# Altium schematic sheet Sensor.schdoc
size 265 x 151 mm; SheetNumber: 2; SheetTotal: 2
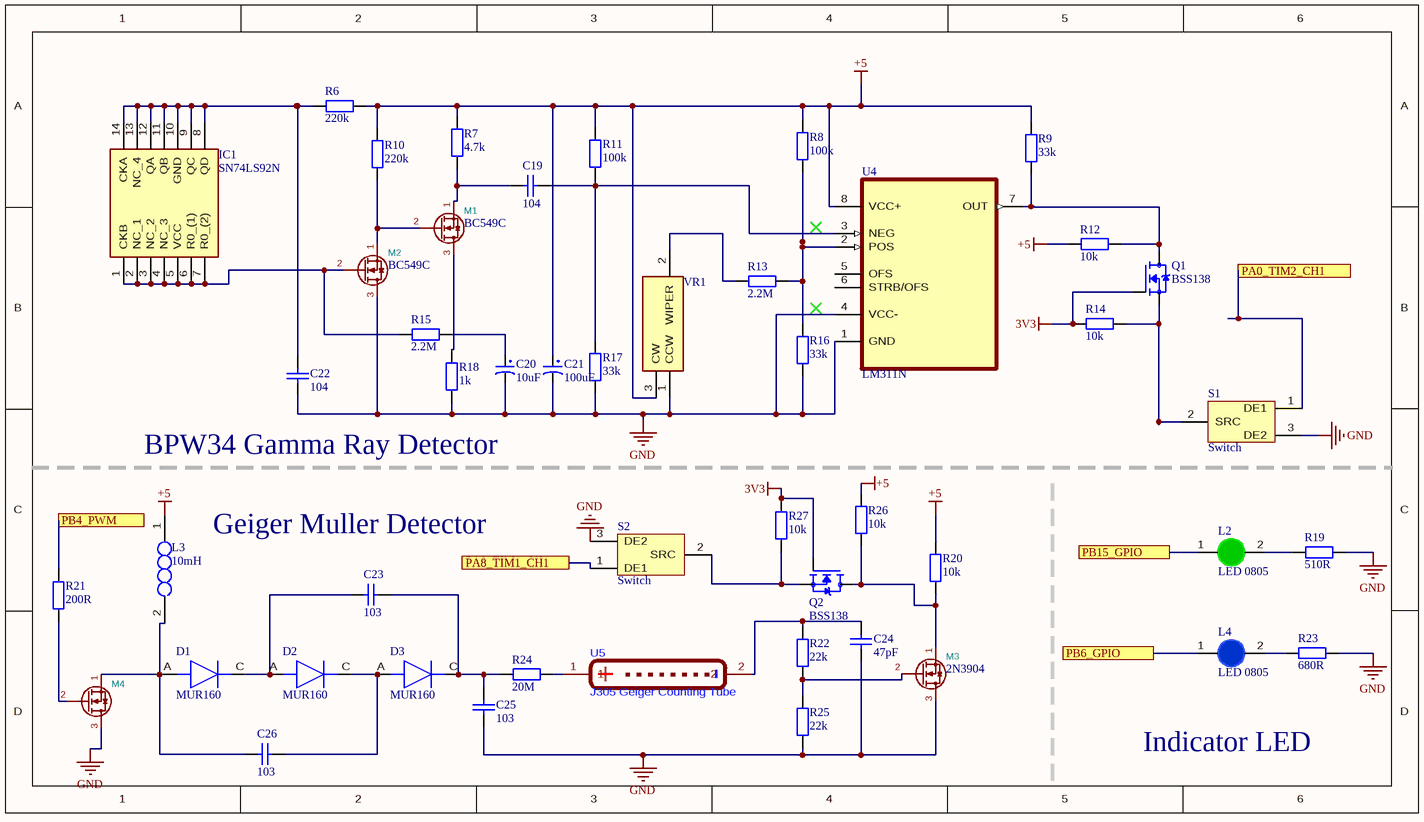
[diagram p0: Sensor.schdoc]

## Parts
C19  104  [tu 0805]
C20  10uF  [tu tantalum smd3216]
C21  100uF  [tu tantalum smd7343]
C22  104  [tu 0805]
C23  103  [tu gom]
C24  47pF  [tu 0805]
C25  103  [tu gom]
C26  103  [tu gom]
D1  MUR160  [DIOAD1300W80L670D310]
D2  MUR160  [DIOAD1300W80L670D310]
D3  MUR160  [DIOAD1300W80L670D310]
IC1  SN74LS92N  [DIP794W53P254L1930H508Q14N]
L2  LED 0805  [LED-0805-Green]
L3  10mH  [RLB1314-101KL]
L4  LED 0805  [LED-0805-Blue]
M1  BC549C  [BC549C]
M2  BC549C  [BC549C]
M3  2N3904  [BC549C]
M4  (no value)  [MJE13003]
Q1  BSS138  [SOT95P240X111-3N]
Q2  BSS138  [SOT95P240X111-3N]
R6  220k  [tro smd 0805]
R7  4.7k  [tro smd 0805]
R8  100k  [tro smd 0805]
R9  33k  [tro smd 0805]
R10  220k  [tro smd 0805]
R11  100k  [tro smd 0805]
R12  10k  [tro smd 0805]
R13  2.2M  [tro smd 0805]
R14  10k  [tro smd 0805]
R15  2.2M  [tro smd 0805]
R16  33k  [tro smd 0805]
R17  33k  [tro smd 0805]
R18  1k  [tro smd 0805]
R19  510R  [tro smd 0805]
R20  10k  [tro smd 0805]
R21  200R  [tro smd 0805]
R22  22k  [tro smd 0805]
R23  680R  [Tro SMD 0805]
R24  20M  [tro smd 0805]
R25  22k  [tro smd 0805]
R26  10k  [tro smd 0805]
R27  10k  [tro smd 0805]
S1  Switch  [Switch]
S2  Switch  [Switch]
U4  LM311N  [LM311N]
U5  J305 Geiger Counting Tube  [GEIGER-TUBE-SMD_J305]
VR1  (no value)  [3362P_1]

## Ports
PA0_TIM2_CH1, PA8_TIM1_CH1, PB4_PWM, PB6_GPIO, PB15_GPIO

## Nets
3V3: Q1.1(G) Q2.1(G) R14.2 R27.2
+5: C21.1 L3.1 R6.2 R7.2 R8.2 R9.2 R10.2 R11.2 R12.2 R20.2 R26.2 U4.8(VCC+) VR1.3(CW)
GND: C20.2 C21.2 C22.2 C24.2 C25.2 M2.3(D) M3.3(D) M4.3(D) R16.1 R17.1 R18.1 R19.2 R23.2 R25.1 S1.3(DE2) S2.3(DE2) U4.1(GND) U4.4(VCC-) VR1.1(CCW)
PA0_TIM2_CH1: S1.1(DE1) ; port PA0_TIM2_CH1
PA8_TIM1_CH1: S2.1(DE1) ; port PA8_TIM1_CH1
PB4_PWM: R21.2 ; port PB4_PWM
PB6_GPIO: L4.1(A) ; port PB6_GPIO
PB15_GPIO: L2.1(A) ; port PB15_GPIO
NetC19_1: C19.1 M1.1(S) R7.1
NetC19_2: C19.2 R11.1 R17.2 U4.3(NEG)
NetC20_1: C20.1 R15.2
NetC22_1: C22.1 IC1.8(QD) IC1.9(QC) IC1.10(GND) IC1.11(QB) IC1.12(QA) IC1.13(NC_4) IC1.14(CKA) R6.1
NetC23_1: C23.1 C25.1 D3.C(K) R24.1
NetC23_2: C23.2 D1.C(K) D2.A
NetC24_1: C24.1 R22.2 U5.2
NetC26_1: C26.1 D2.C(K) D3.A
NetC26_2: C26.2 D1.A L3.2 M4.1(S)
NetIC1_1: IC1.1(CKB) IC1.2(NC_1) IC1.3(NC_2) IC1.4(NC_3) IC1.5(VCC) IC1.6(R0_(1)) IC1.7(R0_(2)) M2.2(G) R15.1
NetL2_2: L2.2(K) R19.1
NetL4_2: L4.2(K) R23.1
NetM1_2: M1.2(G) M2.1(S) R10.1
NetM1_3: M1.3(D) R18.2
NetM3_1: M3.1(S) Q2.3(D) R20.1 R26.1
NetM3_2: M3.2(G) R22.1 R25.2
NetM4_2: M4.2(G) R21.1
NetQ1_2: Q1.2(S) R14.1 S1.2(SRC)
NetQ1_3: Q1.3(D) R9.1 R12.1 U4.7(OUT)
NetQ2_2: Q2.2(S) R27.1 S2.2(SRC)
NetR8_1: R8.1 R13.2 R16.2 U4.2(POS)
NetR13_1: R13.1 VR1.2(WIPER)
NetR24_2: R24.2 U5.1

Not connected (* = marked no-connect by the designer): S1 4 5; S2 4 5; U4 5(OFS) 6(STRB/OFS)

## Notes on the sheet
- BPW34 Gamma Ray Detector
- Geiger Muller Detector
- Indicator LED
- (in symbol J305 Geiger Counting Tube) +; -

## Library data of the parts
C19 C22 = Tu 0805 104 50V 10%: Dán; Don_Vi: Con; So_Chan: 2; Ten_Linh_Kien: Tụ 0805 104-100nF 10% 50V; Ma_Hang: MH004551; Chung_Loai: Dán; Kieu_Chan: *
C20 = Tu tantalum 10uF 16V SMD3216: Dán; Don_Vi: Con; So_Chan: 2; Ten_Linh_Kien: Tụ tantalum 106C-10uF 16V SMD3216; Ma_Hang: MH001954; Chung_Loai: Dán; Kieu_Chan: *
C21 = Tu tantalum 100uF 16V SMD7343: Dán; Don_Vi: Con; So_Chan: 2; Ten_Linh_Kien: Tụ tantalum 107C-100uF 16V SMD7343; Ma_Hang: MH002346; Chung_Loai: Dán; Kieu_Chan: *
C23 C25 C26 = Tu gom 103 50V: Cắm; So_Chan: 2; Ten_Linh_Kien: Tụ gốm 103 10nF 50V; Don_Vi: Con; Ma_Hang: MH000936; Chung_Loai: Cắm; Kieu_Chan: *
C24 = Tu 0805 33pF 50V 10%: Dán; Don_Vi: Con; So_Chan: 2; Ten_Linh_Kien: Tụ 0805 33p 10% 50V; Ma_Hang: MH004563; Chung_Loai: Dán; Kieu_Chan: *
D1-D3 = MUR160: Diode; Manufacturer_Name: onsemi; Manufacturer_Part_Number: UF4007; Datasheet Link: https://www.onsemi.com/pub/Collateral/UF4007-D.pdf; Mouser Part Number: 512-UF4007; Mouser Price/Stock: https://www.mouser.co.uk/ProductDetail/onsemi-Fairchild/UF4007?qs=NwIfwa72FlplAHiXupLMBA%3D%3D; Arrow Part Number: UF4007; Arrow Price/Stock: https://www.arrow.com/en/products/uf4007/on-semiconductor?utm_currency=USD&region=europe
IC1 = SN74LS92N: Integrated Circuit; Manufacturer_Name: Texas Instruments; Datasheet Link: http://www.ti.com/lit/gpn/sn74ls92; Height: 5.08mm; Manufacturer_Part_Number: SN74LS92N; Mouser Part Number: 595-SN74LS92N; Mouser Price/Stock: https://www.mouser.co.uk/ProductDetail/Texas-Instruments/SN74LS92N?qs=UG%2F8xqv%2F6WcRLlC4vw0bYA%3D%3D; Arrow Part Number: SN74LS92N; Arrow Price/Stock: https://www.arrow.com/en/products/sn74ls92n/texas-instruments?utm_currency=USD&region=nac
L2 = LED 0805 Xanh La: Dán; Don_Vi: Con; Ma_Hang: MH002326; Ten_Linh_Kien: LED 0805 Màu Xanh Lá (Green); Ghi_Chu: *; Kieu_Chan: *; Chung_Loai: Dán
L3 = RLB1314-101KL: Inductor; Manufacturer_Name: Bourns; Datasheet Link: https://datasheet.datasheetarchive.com/originals/distributors/SFDatasheet-7/sf-000140383.pdf; Manufacturer_Part_Number: RLB1314-101KL; Mouser Part Number: 652-RLB1314-101KL; Mouser Price/Stock: https://www.mouser.co.uk/ProductDetail/Bourns/RLB1314-101KL?qs=AC4ivEYFOTANeGVpHnHmUA%3D%3D; Arrow Part Number: RLB1314-101KL; Arrow Price/Stock: https://www.arrow.com/en/products/rlb1314-101kl/bourns?region=europe
L4 = LED 0805 Xanh Duong: Dán; Don_Vi: Con; Ma_Hang: MH002327; Ten_Linh_Kien: LED 0805 Màu Xanh Dương (Blue); Ghi_Chu: *; Kieu_Chan: *; Chung_Loai: Dán
M1-M3 = BC549C: ki_keywords: MOSFET N-channel; ki_description: N-Channel Power-MOSFET
M4 = MJE13003: ki_keywords: MOSFET N-channel; ki_description: N-Channel Power-MOSFET
Q1 Q2 = BSS138: N-Channel 50 V 220mA (Ta) 350mW (Ta) Surface Mount SOT-23-3; MF: onsemi; SnapEDA_Link: https://www.snapeda.com/parts/BSS138/Onsemi/view-part/?ref=snap; Package: SOT-23-3 ON Semiconductor; Value: *; MP: BSS138; Check_prices: https://www.snapeda.com/parts/BSS138/Onsemi/view-part/?ref=eda
R6 R10 R13 R15 = Tro 0805 5% 220k: Dán; Don_Vi: Con; So_Chan: 2; Ten_Linh_Kien: Trở 0805 5% 220k; Ma_Hang: MH005258; Chung_Loai: Dán; Kieu_Chan: *
R7 = Tro 0805 5% 4.7k: Dán; Don_Vi: Con; So_Chan: 2; Ten_Linh_Kien: Trở 0805 5% 4.7k; Ma_Hang: MH005307; Chung_Loai: Dán; Kieu_Chan: *
R8 R11 = Tro 0805 5% 100k: Dán; Don_Vi: Con; So_Chan: 2; Ten_Linh_Kien: Trở 0805 5% 100k; Ma_Hang: MH005250; Chung_Loai: Dán; Kieu_Chan: *
R9 R16 R17 = Tro 0805 5% 33k: Dán; Don_Vi: Con; So_Chan: 2; Ten_Linh_Kien: Trở 0805 5% 33k; Ma_Hang: MH005316; Chung_Loai: Dán; Kieu_Chan: *
R12 R14 R20 R26 R27 = Tro 0805 5% 10k: Dán; Don_Vi: Con; So_Chan: 2; Ten_Linh_Kien: Trở 0805 5% 10k; Ma_Hang: MH005239; Chung_Loai: Dán; Kieu_Chan: *
R18 = Tro 0805 1% 1k: Dán; Don_Vi: Con; So_Chan: 2; Ten_Linh_Kien: Trở 0805 1% 1k; Ma_Hang: MH005468; Chung_Loai: Dán; Kieu_Chan: *
R19 = Tro 0805 1% 510k: Dán; Don_Vi: Con; So_Chan: 2; Ten_Linh_Kien: Trở 0805 1% 510k; Ma_Hang: MH005486; Chung_Loai: Dán; Kieu_Chan: *
R21 = Tro 0805 5% 200R: Dán; Don_Vi: Con; So_Chan: 2; Ten_Linh_Kien: Trở 0805 5% 200R; Ma_Hang: MH005257; Chung_Loai: Dán; Kieu_Chan: *
R22 R24 R25 = Tro 0805 5% 22k: Dán; Don_Vi: Con; So_Chan: 2; Ten_Linh_Kien: Trở 0805 5% 22k; Ma_Hang: MH005248; Chung_Loai: Dán; Kieu_Chan: *
R23 = Tro 0805 5% 680R: Dán; Don_Vi: Con; Ma_Hang: MH005344; So_Chan: 2; Ten_Linh_Kien: Trở 0805 5% 680R; Chung_Loai: Dán; Kieu_Chan: *
U4 = LM311N: Comparator General Purpose DTL, MOS, Open-Collector, Open-Emitter, RTL, TTL 8-PDIP; MF: ON Semiconductor; MP: LM311N; SnapEDA_Link: https://www.snapeda.com/parts/LM311N/ON%20Semiconductor/view-part/11709/?ref=snap; Availability: Bad; Package: PDIP-8 ON Semiconductor; Check_prices: https://www.snapeda.com/parts/LM311N/ON%20Semiconductor/view-part/11709/?ref=eda; Value: *; Price: None
VR1 = 3362P-1-253LF: Variable Resistor; Manufacturer_Name: Bourns; Datasheet Link: https://www.bourns.com/docs/Product-Datasheets/3362.pdf; Manufacturer_Part_Number: 3362P-1-253LF; Mouser Part Number: 652-3362P-1-253LF; Mouser Price/Stock: https://www.mouser.co.uk/ProductDetail/Bourns/3362P-1-253LF?qs=zzU3Rk5EtVOwWhuxjgYxLA%3D%3D; Arrow Part Number: 3362P-1-253LF; Arrow Price/Stock: https://www.arrow.com/en/products/3362p-1-253lf/bourns?region=nac